# EAGLE design 5vadc (EAGLE 9.6.2)
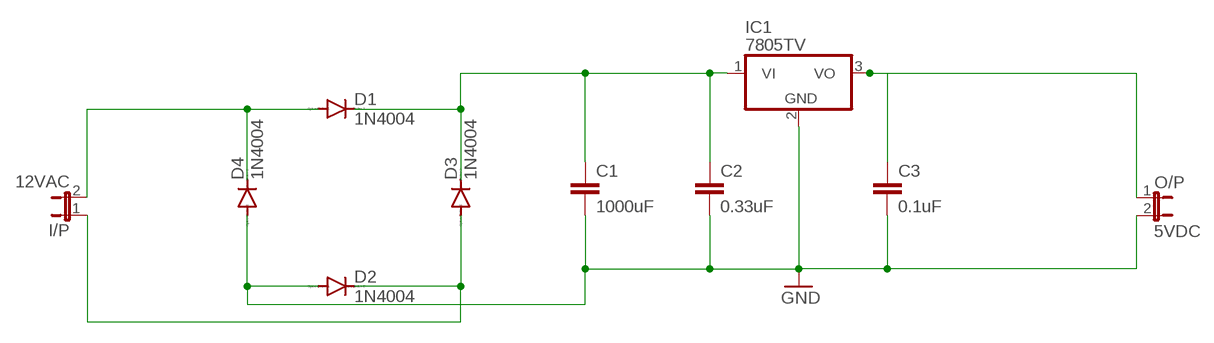
[diagram p0: schematic, sheet 1]

## Parts
C1  1000uF  C2,5-3  [C2.5-3]
C2  0.33uF  C2,5-3  [C2.5-3]
C3  0.1uF  C2,5-3  [C2.5-3]
D1  1N4004  [DO41-10]
D2  1N4004  [DO41-10]
D3  1N4004  [DO41-10]
D4  1N4004  [DO41-10]
I/P  12VAC  JP1E  [JP1]
IC1  7805TV  [TO220V]
O/P  5VDC  JP1E  [JP1]

## Nets
GND: C1.2 C2.2 C3.2 D2.A D4.A IC1.2(GND) O/P.2
N$2: C3.1 IC1.3(VO) O/P.1
N$8: D1.A D4.C I/P.2
N$9: C1.1 C2.1 D1.C D3.C IC1.1(VI)
N$10: D2.C D3.A I/P.1

## Library data of the parts
C1-C3 = capacitor-wima:C: CAPACITOR naming: grid - package width
D1-D4 = diode:1N4004: DIODE general purpose rectifier, 1 A
I/P O/P = jumper:JP1E: JUMPER
IC1 = linear:78*: Positive VOLTAGE REGULATOR Source: http://cache.national.com/ds/LM/LM78L05.pdf http://www.fairchildsemi.com/ds/LM/LM7805.pdf

## Board
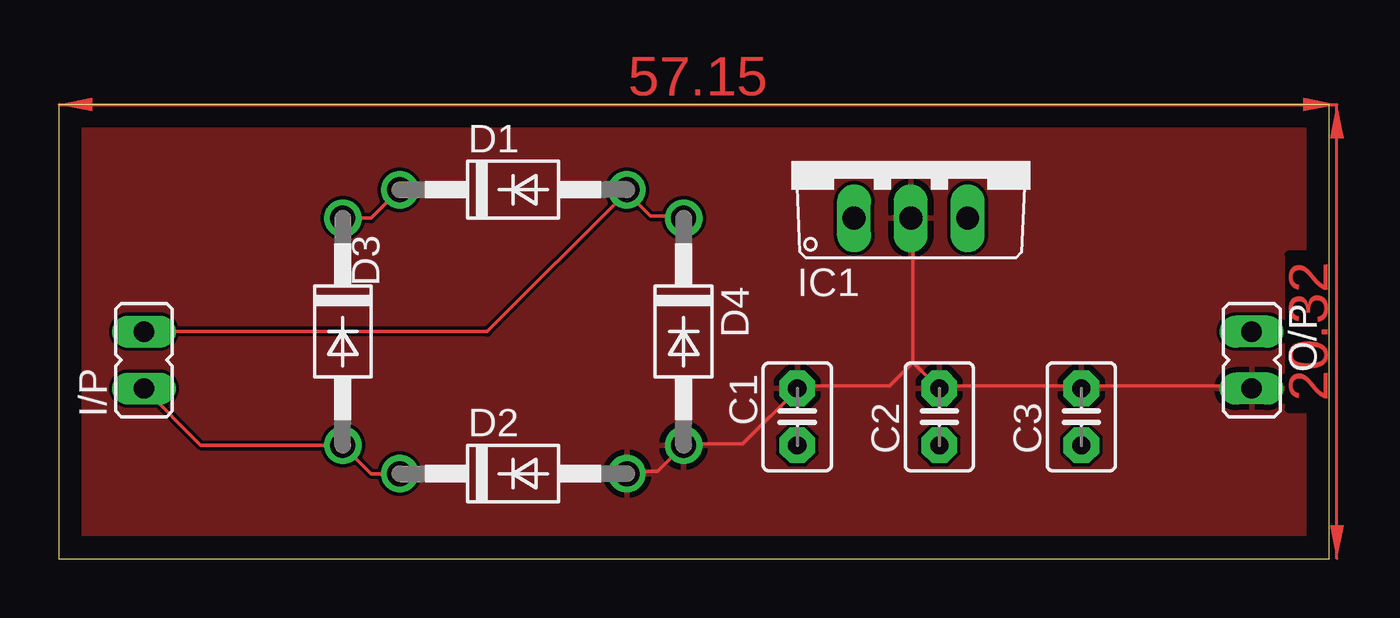
[diagram p1: board, top side]
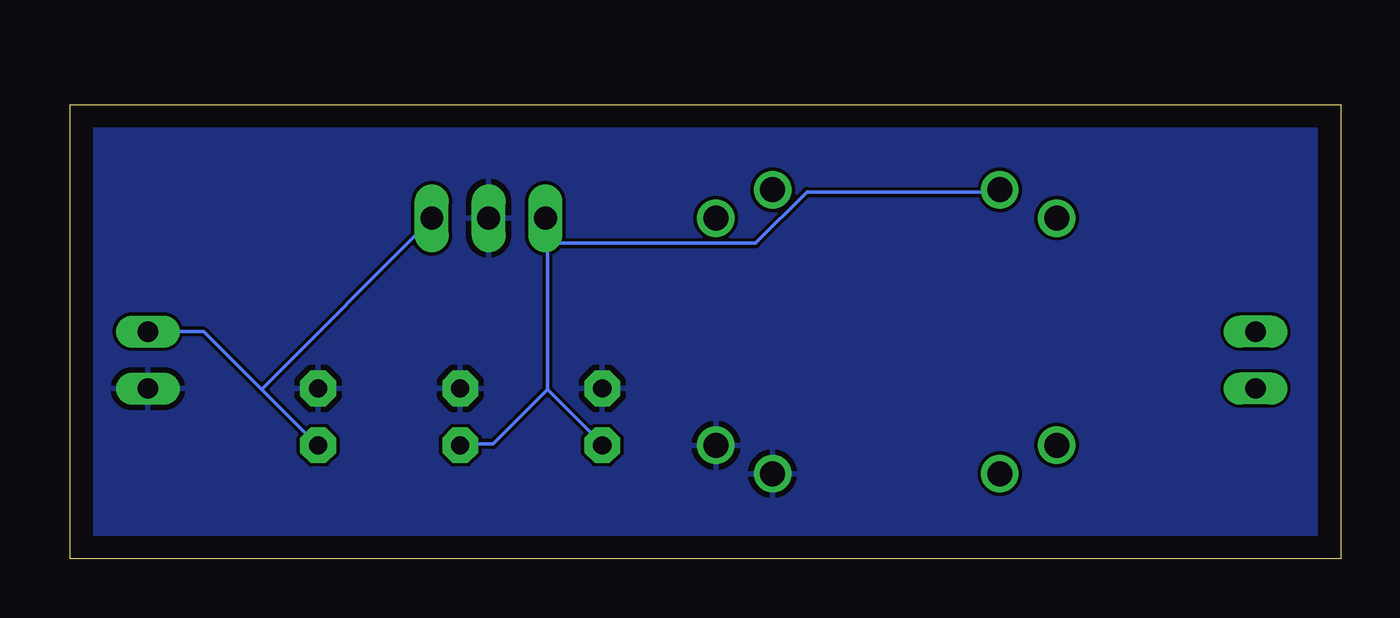
[diagram p2: board, bottom side, seen from below]

Size 56.82 x 20.31 mm. Coordinates in mm from the lower left corner, seen from the top.
Outline: 0,0 56.82,0 56.82,20.31 0,20.31 0,0
Copper layers (1*16): Top 0.035mm / dielectric 1.5mm / Bottom 0.035mm
Design rules "default": minimum track width 6mil, minimum drill 0.35mm, track to track 6mil, track to pad 6mil, pad to pad 6mil, via to via 6mil, smd to smd 6mil, copper to edge 40mil, drill to drill 6mil, minimum pad ring 10mil, minimum via ring 8mil, stop-mask expansion 4mil, vias tented up to drill 0mil, thermal gap 10mil

### Footprints (pad centres in the part's own frame; a part is rotated, then mirrored left to right if it is on the bottom)
C2.5-3 = drill 0.813 pad 1.6 octagon: 1 -1.27,0; 2 1.27,0
DO41-10 = drill 1.118: A 5.08,0; C -5.08,0
JP1 = drill 0.914 long: 1 0,-1.27; 2 0,1.27
TO220V = drill 1.016 long: 1 -2.54,-2.54; 2 0,-2.54; 3 2.54,-2.54

### Placement (x,y rotation side)
C1  33.02,6.35 90 top
C2  39.37,6.35 90 top
C3  45.72,6.35 90 top
D1  20.32,16.51 0 top
D2  20.32,3.81 0 top
D3  12.7,10.16 270 top
D4  27.94,10.16 270 top
I/P  3.81,8.89 0 top
IC1  38.1,17.78 0 top
O/P  53.34,8.89 180 top

### Tracks (layer width: path | path; a pad name or v marks a point on that pad's centre or on a via)
GND
  Top 0.152: O/P.2 53.29,7.72 45.82,7.72 C3.2 45.67,7.72 39.42,7.72 C2.2 38.2,8.79 | D2.A 25.4,3.91 26.77,3.91 D4.A 27.99,5.13 30.58,5.13 33.02,7.57 C1.2 33.02,7.72 37.13,7.72 38.2,8.79 | 38.2,8.79 38.2,15.19 IC1.2
  pour Top: 0,21.59 59.69,21.59 59.69,-2.54 -1.27,-2.54 -1.27,-1.27 -1.27,21.59
  pour Bottom: 0,22.86 60.96,22.86 60.96,-5.08 0,-5.08
N$2
  Bottom 0.152: O/P.1 50.85,10.16 48.26,7.57 | 48.26,7.57 45.82,5.13 C3.1 | 48.26,7.57 40.64,15.19 IC1.3
N$8
  Top 0.152: I/P.2 19.15,10.16 25.4,16.41 | 25.4,16.41 26.47,15.34 27.84,15.34 D4.C | 25.4,16.41 D1.A
N$9
  Top 0.152: D1.C 13.97,15.24 D3.C
  Bottom 0.152: 35.46,7.57 35.46,14.12 | 35.46,14.12 35.46,15.19 IC1.1 35.46,14.12 | 35.46,7.57 33.02,5.13 C1.1 | 35.46,7.57 37.9,5.13 39.27,5.13 C2.1 | 35.46,14.12 26.16,14.12 23.88,16.41 15.34,16.41 D1.C
N$10
  Top 0.152: I/P.1 6.35,5.08 D3.A 13.97,3.81 D2.C
(copper drawn outside any net)
  shapes: Top area x2